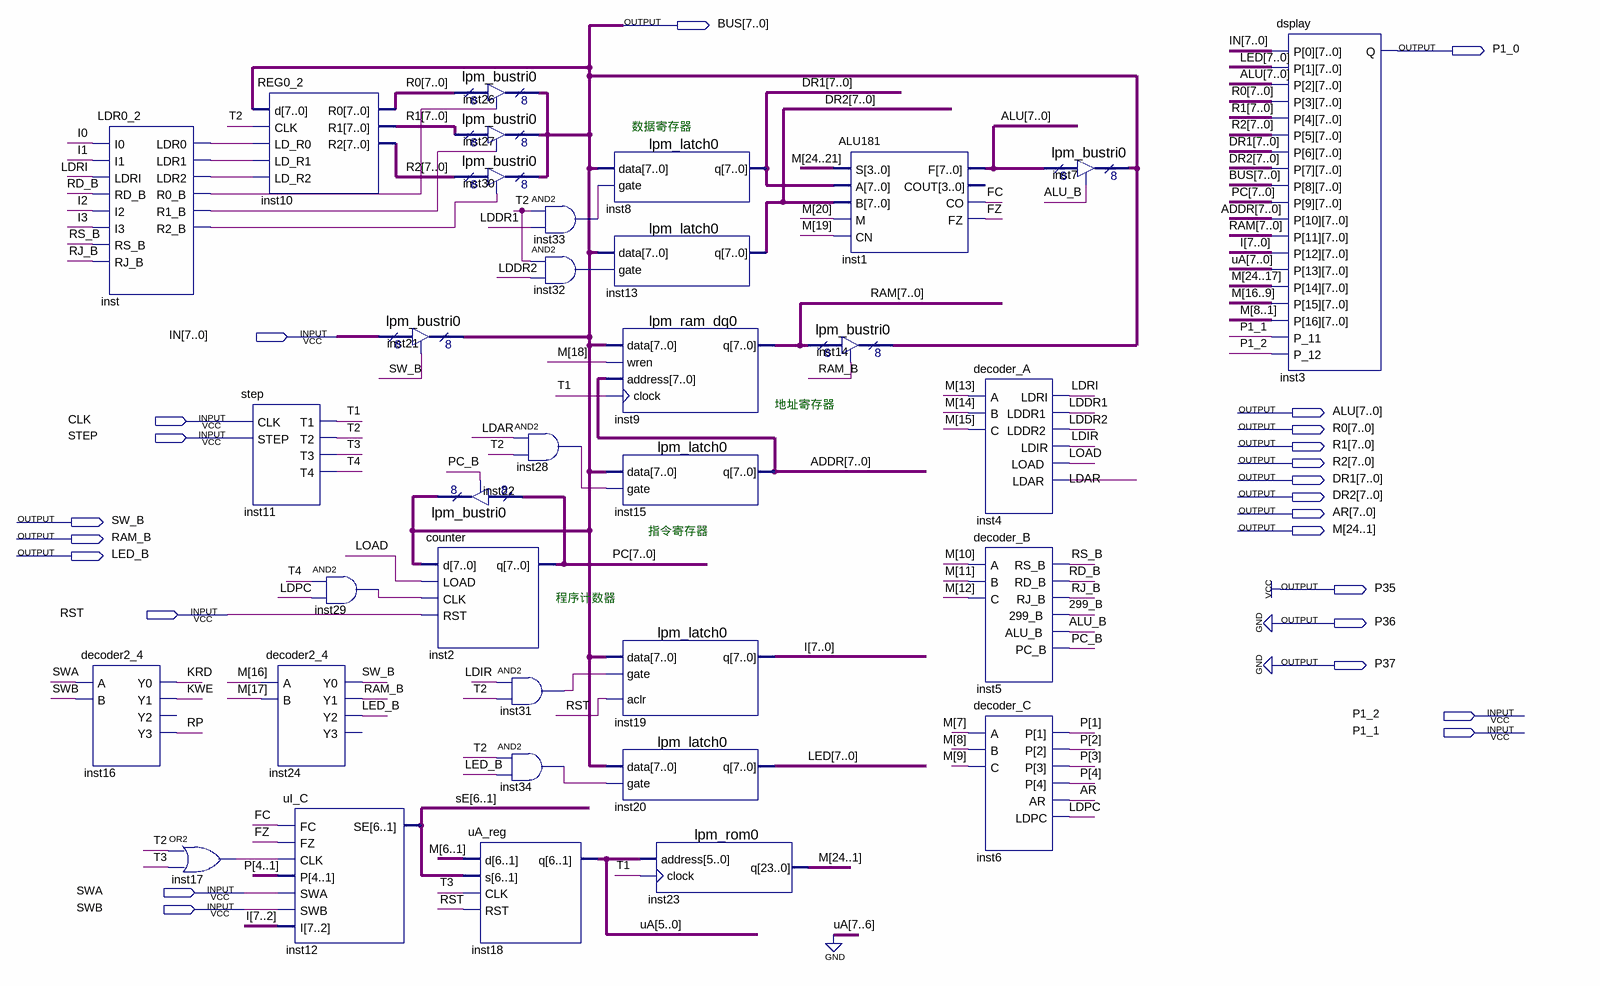
[diagram p0: schematic sheet]
// Quartus schematic CPU5.bdf as structural Verilog: 34 symbols, 24 pins
module CPU5 (
  input  [7:0] IN,
  input  CLK,
  input  STEP,
  input  RST,
  input  P1_2,
  input  P1_1,
  input  SWA,
  input  SWB,
  output [7:0] BUS,
  output P1_0,
  output [7:0] ALU,
  output [7:0] R0,
  output [7:0] R1,
  output [7:0] R2,
  output [7:0] DR1,
  output [7:0] DR2,
  output [7:0] AR,
  output SW_B,
  output [24:1] M,
  output RAM_B,
  output LED_B,
  output P35,
  output P36,
  output P37
);

  wire \299_B , ALU_B, AR_1bit, FC, FZ, inst17_out, inst28_out, inst29_out, inst31_out, inst32_out,
       inst33_out, inst34_out, inst_ldr0, inst_ldr1, inst_ldr2, inst_r0_b, inst_r1_b, inst_r2_b, KRD, KWE,
       LDAR, LDDR1, LDDR2, LDIR, LDPC, LDRI, LOAD, PC_B, RD_B, RJ_B, RP, RS_B, T1, T2, T3, T4;
  wire [4:1] P;
  wire [5:0] uA;
  wire [6:1] sE;
  wire [7:0] ADDR, I, LED, PC, RAM;

  LDR0_2 inst (
    .I0(I[0]), .I1(I[1]), .LDRI(LDRI), .RD_B(RD_B), .I2(I[2]), .I3(I[3]), .RS_B(RS_B), .RJ_B(RJ_B),
    .LDR0(inst_ldr0), .LDR1(inst_ldr1), .LDR2(inst_ldr2), .R0_B(inst_r0_b), .R1_B(inst_r1_b), .R2_B(inst_r2_b));
  decoder2_4 inst16 (.A(SWA), .B(SWB), .Y0(KRD), .Y1(KWE), .Y3(RP));  // open: Y2
  or inst17 (inst17_out, T2, T3);
  REG0_2 inst10 (.d(BUS), .CLK(T2), .LD_R0(inst_ldr0), .LD_R1(inst_ldr1), .LD_R2(inst_ldr2), .R0(R0), .R1(R1), .R2(R2));
  step inst11 (.CLK(CLK), .STEP(STEP), .T1(T1), .T2(T2), .T3(T3), .T4(T4));
  and inst29 (inst29_out, T4, LDPC);
  decoder2_4 inst24 (.A(M[16]), .B(M[17]), .Y0(SW_B), .Y1(RAM_B), .Y2(LED_B));  // open: Y3
  uI_C inst12 (.FC(FC), .FZ(FZ), .CLK(inst17_out), .P(P), .SWA(SWA), .SWB(SWB), .I(I[7:2]), .SE(sE));
  lpm_bustri0 inst21 (.enabledt(SW_B), .data(IN), .tridata(BUS));
  lpm_bustri0 inst26 (.enabledt(inst_r0_b), .data(R0), .tridata(BUS));
  lpm_bustri0 inst27 (.enabledt(inst_r1_b), .data(R1), .tridata(BUS));
  lpm_bustri0 inst30 (.enabledt(inst_r2_b), .data(R2), .tridata(BUS));
  lpm_bustri0 inst22 (.enabledt(PC_B), .data(PC), .tridata(BUS));
  counter inst2 (.d(BUS), .LOAD(LOAD), .CLK(inst29_out), .RST(RST), .q(PC));
  and inst28 (inst28_out, LDAR, T2);
  and inst31 (inst31_out, LDIR, T2);
  and inst34 (inst34_out, T2, LED_B);
  uA_reg inst18 (.d(M[6:1]), .s(sE), .CLK(T3), .RST(RST), .q(uA));
  and inst33 (inst33_out, T2, LDDR1);
  and inst32 (inst32_out, T2, LDDR2);
  lpm_latch0 inst8 (.data(BUS), .gate(inst33_out), .q(DR1));
  lpm_latch0 inst13 (.data(BUS), .gate(inst32_out), .q(DR2));
  lpm_ram_dq0 inst9 (.data(BUS), .wren(M[18]), .address(ADDR), .clock(T1), .q(RAM));
  lpm_latch0 inst15 (.data(BUS), .gate(inst28_out), .q(ADDR));
  lpm_latch0 inst19 (.data(BUS), .gate(inst31_out), .aclr(RST), .q(I));
  lpm_latch0 inst20 (.data(BUS), .gate(inst34_out), .q(LED));
  lpm_rom0 inst23 (.address(uA), .clock(T1), .q(M));
  ALU181 inst1 (.S(M[24:21]), .A(DR1), .B(DR2), .M(M[20]), .CN(M[19]), .F(ALU), .CO(FC), .FZ(FZ));  // open: COUT
  lpm_bustri0 inst14 (.enabledt(RAM_B), .data(RAM), .tridata(BUS));
  decoder_A inst4 (
    .A(M[13]), .B(M[14]), .C(M[15]), .LDRI(LDRI), .LDDR1(LDDR1), .LDDR2(LDDR2), .LDIR(LDIR), .LOAD(LOAD),
    .LDAR(LDAR));
  decoder_B inst5 (
    .A(M[10]), .B(M[11]), .C(M[12]), .RS_B(RS_B), .RD_B(RD_B), .RJ_B(RJ_B), .\299_B (\299_B ), .ALU_B(ALU_B),
    .PC_B(PC_B));
  decoder_C inst6 (.A(M[7]), .B(M[8]), .C(M[9]), .P(P), .AR(AR_1bit), .LDPC(LDPC));
  lpm_bustri0 inst7 (.enabledt(ALU_B), .data(ALU), .tridata(BUS));
  dsplay inst3 (
    .P_0(IN), .P_1(LED), .P_2(ALU), .P_3(R0), .P_4(R1), .P_5(R2), .P_6(DR1), .P_7(DR2), .P_8(BUS), .P_9(PC),
    .P_10(ADDR), .P_11({RAM, P1_1}), .P_12({I, P1_2}), .P_13({2'b00, uA}), .P_14(M[24:17]), .P_15(M[16:9]),
    .P_16(M[8:1]), .Q(P1_0));

  assign P35 = 1'b1;
  assign P36 = 1'b0;
  assign P37 = 1'b0;

  // Notes on the sheet:
  //   数据寄存器
  //   地址寄存器
  //   指令寄存器
  //   程序计数器
endmodule
